# Altium schematic sheet GPS_MAX-M8C-0-10.SchDoc
size Letter
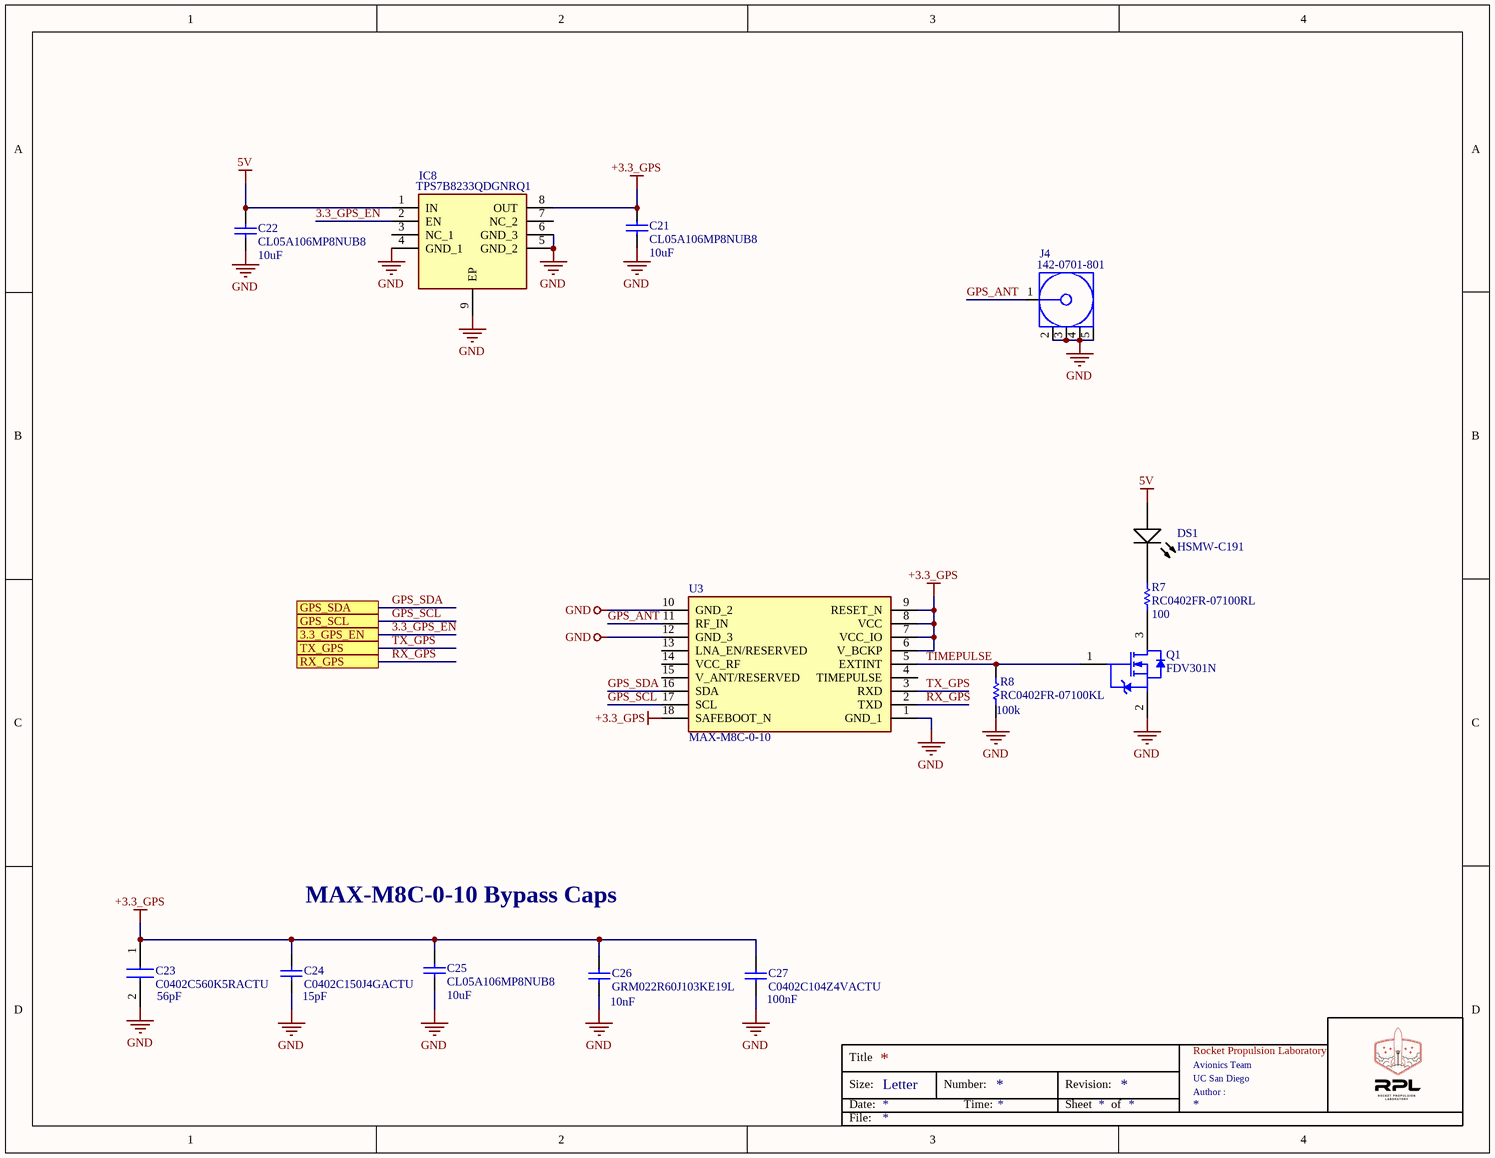
[diagram p0: GPS_MAX-M8C-0-10.SchDoc]

## Parts
C21  CL05A106MP8NUB8  value 10uF  [0402]
C22  CL05A106MP8NUB8  value 10uF  [0402]
C23  C0402C560K5RACTU  value 56pF  [CAPC1005X55N]
C24  C0402C150J4GACTU  value 15pF  [CAPC0402(1005)60_L]
C25  CL05A106MP8NUB8  value 10uF  [0402]
C26  GRM022R60J103KE19L  value 10nF  [CAPC1005X55X25NL05T10]
C27  C0402C104Z4VACTU  value 100nF  [CAPC1005X55X30LL05T10]
DS1  HSMW-C191  [AVAG-HSMW-C191_V]
IC8  TPS7B8233QDGNRQ1  [SOP65P490X110-9N]
J4  142-0701-801  [CINC-142-0701-801_V]
Q1  FDV301N  [FAIR-SOT23-3_V]
R7  RC0402FR-07100RL  spec: 100  [RESC1005X40X25ML05T10]
R8  RC0402FR-07100KL  spec: 100k  [RESC1005X40X25NL05T10]
U3  MAX-M8C-0-10  [MAX-M8]

## Ports
3.3_GPS_EN, GPS_SCL, GPS_SDA, RX_GPS, TX_GPS

## Nets
5V: C22.2 DS1.1(A) IC8.1(IN)
+3.3_GPS: C21.2 C23.1 C24.1 C25.2 C26.2 C27.2 IC8.8(OUT) U3.6(V_BCKP) U3.7(VCC_IO) U3.8(VCC) U3.9(RESET_N) U3.18(SAFEBOOT_N)
GND: C21.1 C22.1 C23.2 C24.2 C25.1 C26.1 C27.1 IC8.4(GND_1) IC8.5(GND_2) IC8.6(GND_3) IC8.9(EP) J4.2 J4.3 J4.4 J4.5 Q1.2(S) R8.2 U3.1(GND_1) U3.10(GND_2) U3.12(GND_3)
3.3_GPS_EN: IC8.2(EN) ; port 3.3_GPS_EN
GPS_ANT: J4.1 U3.11(RF_IN)
GPS_SCL: U3.17(SCL) ; port GPS_SCL
GPS_SDA: U3.16(SDA) ; port GPS_SDA
RX_GPS: U3.2(TXD) ; port RX_GPS
TIMEPULSE: Q1.1(G) R8.1 U3.5(EXTINT)
TX_GPS: U3.3(RXD) ; port TX_GPS
NetDS1_2: DS1.2(K) R7.2
NetQ1_3: Q1.3(D) R7.1

Not connected (* = marked no-connect by the designer): IC8 3(NC_1) 7(NC_2); U3 4(TIMEPULSE) 13(LNA_EN/RESERVED) 14(VCC_RF) 15(V_ANT/RESERVED)

## Notes on the sheet
- MAX-M8C-0-10 Bypass Caps
- Title
- Size:
- Date:
- Letter
- Number:
- Time:
- Revision:
- Sheet
- of
- Rocket Propulsion Laboratory
- UC San Diego
- Avionics Team
- Author :
- File:

## Library data of the parts
C21 C22 C25 = Cap: Capacitor; Published: 8-Jun-2000; LatestRevisionDate: 17-Jul-2002; LatestRevisionNote: Re-released for DXP Platform.; PackageReference: RAD-0.3; Publisher: Altium Limited; PackageDescription: Radial Cap, Thru-Hole; 2 Leads; 0.3 in Pin Spacing
C23 = C0402C560K5RACTU: Capacitor; Manufacturer_Name: Kemet; Datasheet Link: https://content.kemet.com/datasheets/KEM_C1002_X7R_SMD.pdf; Height: 0.55mm; Manufacturer_Part_Number: C0402C560K5RACTU; Arrow Part Number: C0402C560K5RACTU; Mouser Part Number: 80-C0402C560K5RACTU; Mouser Price/Stock: https://www.mouser.co.uk/ProductDetail/KEMET/C0402C560K5RACTU?qs=gt1LBUVyoHmQZW5v3ySgNQ%3D%3D
C24 = CMP-1034-00802-1: CAP 15pF 16V ±5% 0402 (1005 Metric) Thickness 0.6mm SMD; Case-EIA: 0402; Case-Metric: 1005; Tolerance: Â±5%; Max Thickness: 0.6 mm; Technology: SMT; Rated Voltage: 16 V
C26 = CMP-2008-04044-1: Manufacturer: Murata; Part Number: GRM022R60J103KE19L
C27 = CMP-2008-03088-1: Manufacturer: Kemet; Part Number: C0402C104Z4VACTU
DS1 = CMP-1744-00001-1: LED Uni-Color White, 78 mW, 20 mA, -40 to 85 degC, 2-Pin SMD, RoHS, Tape and Reel; Current Rating: 300 mA; Contact Plating: Silver; Width: 12 mm; Package Quantity: 560; ComponentLink2URL: http://docs.avagotech.com/docs/AV02-0186EN; ComponentLink1URL: http://www.avagotech.com/; RoHSCompliant: true; PackageDescription: 2-Pin Surface Mount Device, Body 1.6 x 0.8 mm; Contact Material: Copper; ComponentLink1Description: Manufacturer URL; Mount: Through Hole; Packaging: Bulk; DatasheetVersion: May-10; Height: 12 mm; ComponentLink2Description: Datasheet; Contact Finish: Silver; Max Operating Temperature: 85 degC; Radiation Hardening: No; PackageReference: HSMW-C191; REACH SVHC: Unknown; Min Operating Temperature: -20 degC; Length: 16 mm
IC8 = TPS7B8233QDGNRQ1: Integrated Circuit; Manufacturer_Name: Texas Instruments; Datasheet Link: http://www.ti.com/lit/gpn/tps7b82-q1; Height: 1.1mm; Manufacturer_Part_Number: TPS7B8233QDGNRQ1; Arrow Part Number: TPS7B8233QDGNRQ1; Arrow Price/Stock: https://www.arrow.com/en/products/tps7b8233qdgnrq1/texas-instruments; Mouser Part Number: 595-TPS7B8233QDGNRQ1; Mouser Price/Stock: https://www.mouser.co.uk/ProductDetail/Texas-Instruments/TPS7B8233QDGNRQ1?qs=gTYE2QTfZfTgserf%2FHg6KA%3D%3D
J4 = CMP-2000-05490-1: SMA End Launch Jack Receptacle, 50 Ohm, 0 to 18 GHz, -65 to 165 degC, 5-Pin SMD, RoHS, Bulk; Manufacturer: EmersonConnectivitySolutions; Connector Type: JackPCB; Gender: Jack(Female); Impedance: 50Ohms; Brand: Johnson/EmersonConnectivitySolutions; Body Material: Brass; Body Style: Straight; Maximum Frequency: 18GHz; Factory Pack Quantity: 5; Datasheet URL: https://belfuse.com/resources/Johnson/productinformation/pi-142-0701-801.pdf; Datasheet Version: 12/2014; Operating Temperature Range: -65Cto+165C; Mounting Technology: SurfaceMount; RF Series: SMA; Package Reference: 142-0701-801; Product Category: RFConnectors/CoaxialConnectors; Termination Style: Solder; RoHS: Details; Package URL: https://belfuse.com/resources/Johnson/drawings/dr-1420701801.pdf; Series: SMA; Package Description: 5-Pin Surface Mount Device, Body 14.275 x 9.525 mm; Manufacturer URL: http://www.cinch.com/; Contact Plating: Gold; Product: Connectors; Orientation: Straight
Q1 = CMP-2000-04935-1: Digital FET, N-Channel, 0.35 W, 25 V, -55 to 150 degC, 3-Pin SOT23, RoHS, Tape and Reel; Manufacturer: Fairchild; Rds(on) Test Voltage Vgs: 2.7V; Threshold Voltage Vgs Typ: 850mV; Voltage Vds Typ: 25V; Transistor Case Style: SOT-23; Reel Quantity: 3000; Voltage Vgs Rds on Measurement: 4.5V; Power Dissipation Pd: 350mW; Continuous Drain Current Id: 220mA; Transistor Polarity: NChannel; No. of Transistors: 1; Package Version: Rev. 12, 03/2016; Voltage Vgs th Max: 1.5V; ESD HBM: 6kV; Pulse Current Idm: 500mA; Current Temperature: 25degC; On Resistance Rds(on): 5ohm; External Depth: 2.5mm; SMD Marking: 301; No. of Pins: 3; External Width: 3.05mm; SVHC: NoSVHC(19-Dec-2012); External Length / Height: 1.12mm; Termination Type: SMD; Package Reference: SOT23-3; Package URL: http://www.fairchildsemi.com/dwg/MA/MA03D.pdf; Voltage Vgs Max: 850mV; Drain Source Voltage Vds: 25V; Operating Temperature Max: 150degC; Package Description: 3-Pin Small Outline Transistor, Body 2.92 x 1.325 mm, Pitch 0.95 mm; Operating Temperature Min: -55degC; Datasheet Version: Jun-09; Tape Width: 8mm; Full Power Rating Temperature: 25degC; Datasheet URL: https://datasheet.ciiva.com/8114/fdv301n-8114688.pdf; Package / Case: SOT-23; Manufacturer URL: https://www.fairchildsemi.com/; Current Id Max: 220mA; Operating Temperature Range: -55degCto+150degC; ComponentLink1Description: datasheety; ComponentLink1URL: https://www.onsemi.com/pub/Collateral/FDV301N-D.PDF
R7 = CMP-2002-07344-1: Manufacturer: Yageo / Phycomp; Part Number: RC0402FR-07100RL
R8 = CMP-2002-07343-1: Manufacturer: Yageo / Phycomp; Part Number: RC0402FR-07100KL
U3 = MAX-M8C-0-10: Undefined or Miscellaneous; Manufacturer_Name: U-Blox; Datasheet Link: https://www.u-blox.com/sites/default/files/MAX-M8-FW3_DataSheet_%28UBX-15031506%29.pdf; Manufacturer_Part_Number: MAX-M8C-0-10; Arrow Part Number: MAX-M8C-0-10